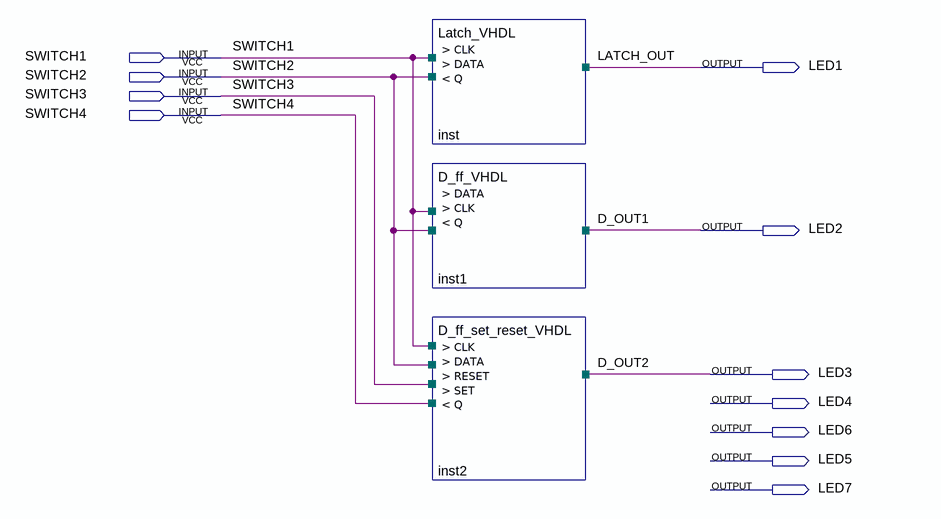
[diagram p0: schematic sheet]
// Quartus schematic ex6_VHDL_flipflop.bdf as structural Verilog: 3 symbols, 11 pins
module ex6_VHDL_flipflop (
  input  SWITCH1,
  input  SWITCH2,
  input  SWITCH3,
  input  SWITCH4,
  output LED1,
  output LED2,
  output LED3,
  output LED4,
  output LED6,
  output LED5,
  output LED7
);

  Latch_VHDL inst (.CLK(SWITCH1), .DATA(SWITCH2), .Q(LED1));
  D_ff_VHDL inst1 (.DATA(SWITCH2), .CLK(SWITCH1), .Q(LED2));
  D_ff_set_reset_VHDL inst2 (.CLK(SWITCH1), .DATA(SWITCH2), .RESET(SWITCH4), .SET(SWITCH3), .Q(LED3));

  // Other names for the same wires on the sheet: D_OUT1 = LED2; D_OUT2 = LED3; LATCH_OUT = LED1
endmodule
